# EAGLE design Silent Stepper Driver X Axis (EAGLE 7.5.0)
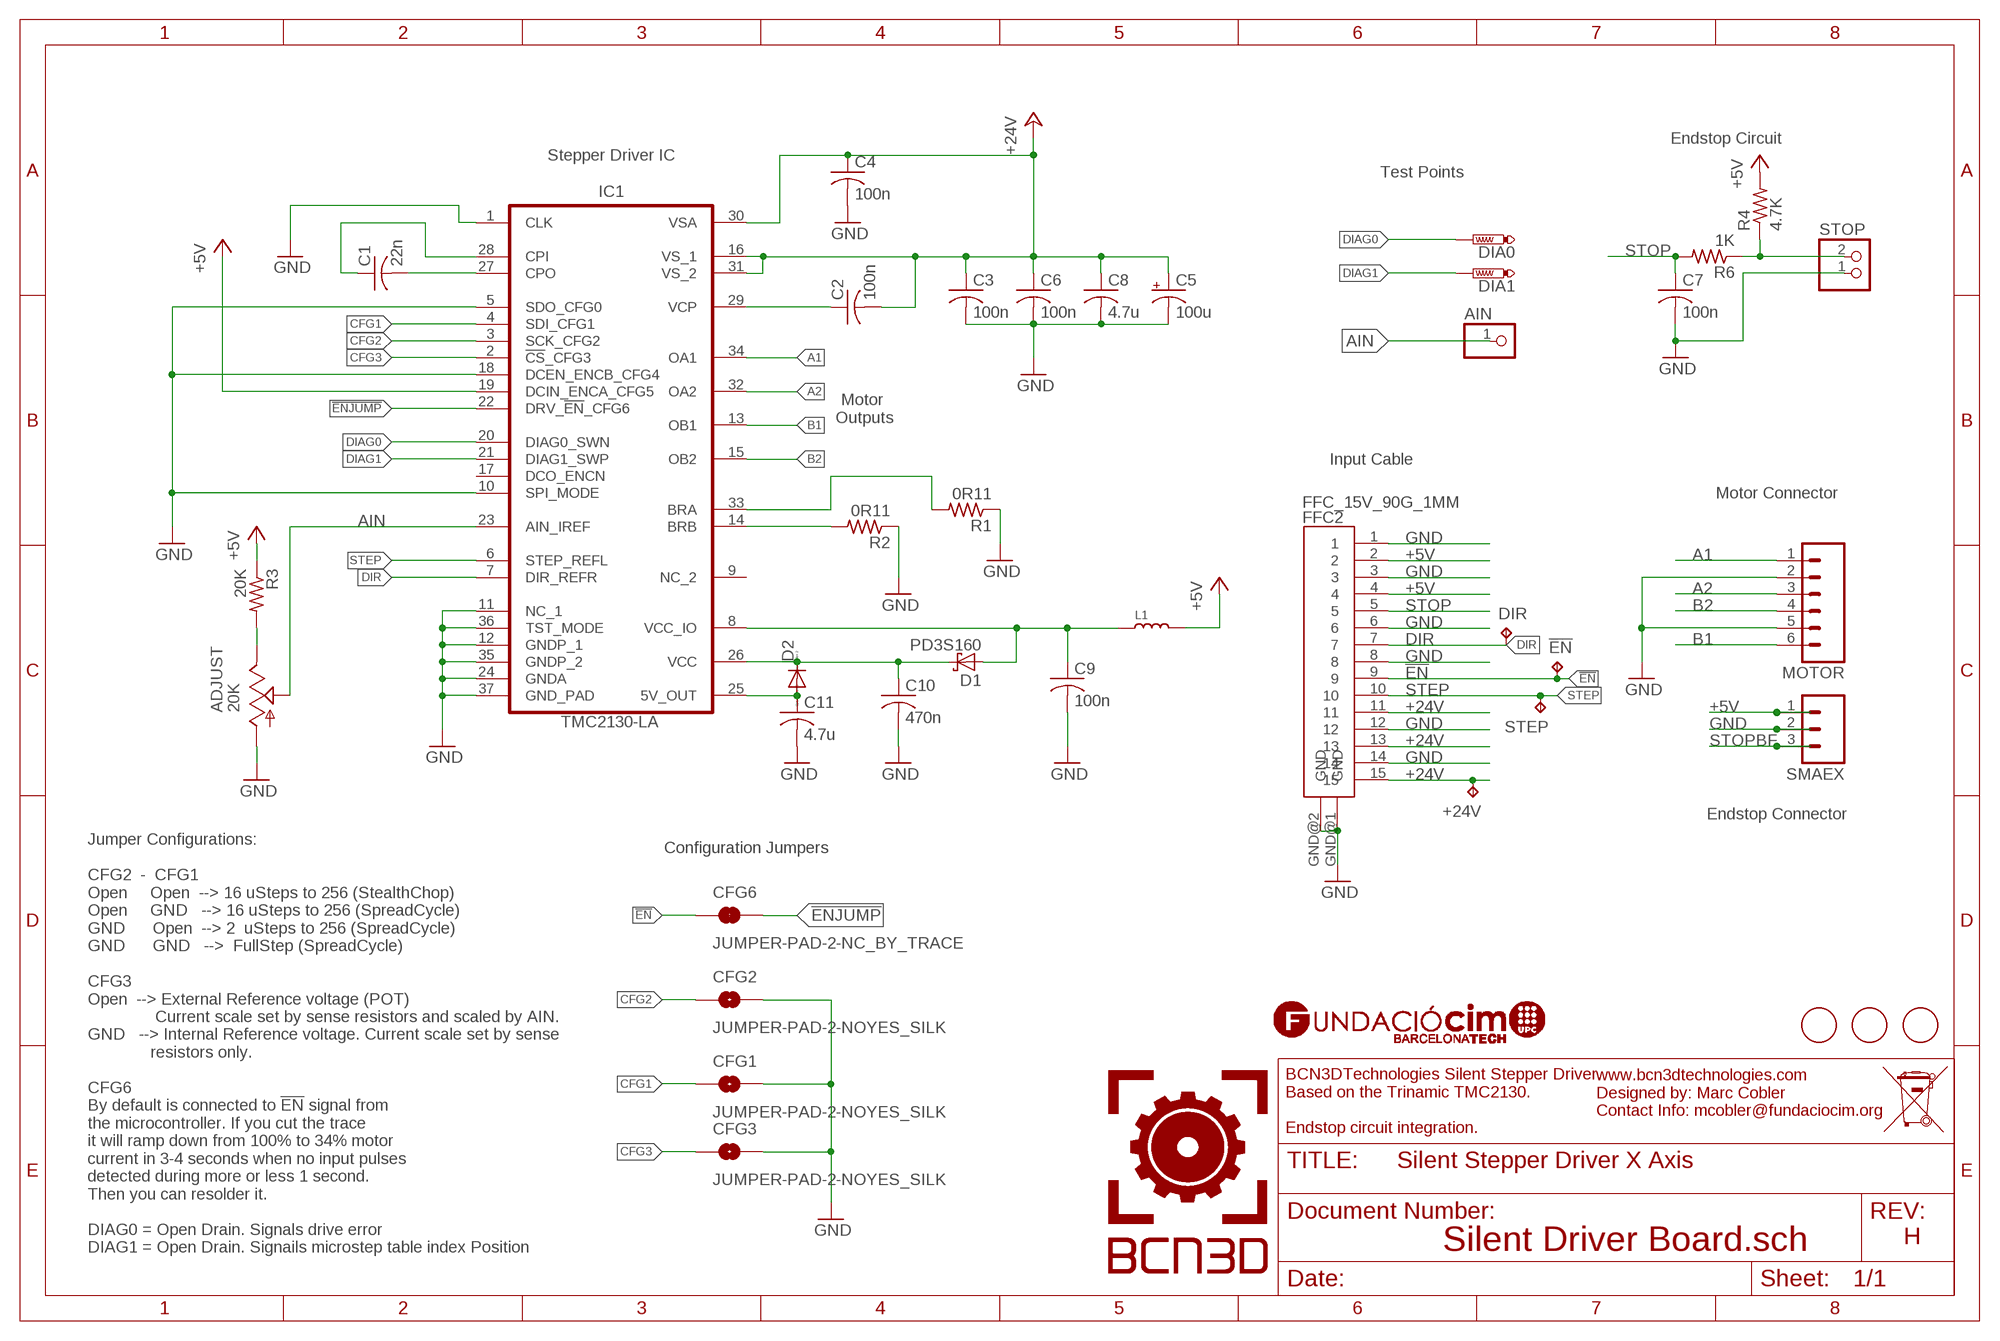
[diagram p0: schematic, sheet 1]

## Parts
!EN  TPB1,27  [B1,27]
+24V  TPB1,27  [B1,27]
ADJUST  20K  TRIM_US-3223G  [3223G]
AIN  PINHD-1X1  [1X01]
C1  22n  C-USC0603K  [C0603K]
C2  100n  C-USC0603K  [C0603K]
C3  100n  C-USC0603K  [C0603K]
C4  100n  C-USC0603K  [C0603K]
C5  100u  CPOL-USUD-6,3X7,7  [UD-6,3X7,7_NICHICON]
C6  100n  C-USC0603K  [C0603K]
C7  100n  C-USC0603K  [C0603K]
C8  4.7u  C-USC1210  [C1210]
C9  100n  C-USC0603K  [C0603K]
C10  470n  C-USC0603K  [C0603K]
C11  4.7u  C-USC0805  [C0805]
CFG1  JUMPER-PAD-2-NOYES_SILK  [PAD-JUMPER-2-NO_YES_SILK]
CFG2  JUMPER-PAD-2-NOYES_SILK  [PAD-JUMPER-2-NO_YES_SILK]
CFG3  JUMPER-PAD-2-NOYES_SILK  [PAD-JUMPER-2-NO_YES_SILK]
CFG6  JUMPER-PAD-2-NC_BY_TRACE  [PAD-JUMPER-2-NC_BY_TRACE_YES_SILK]
D1  PD3S160  [POWERDI323]
D2  DIODE-MINIMELF  [MINIMELF]
DIA0  PTR1TP12R  [TP12R]
DIA1  PTR1TP12R  [TP12R]
DIR  TPB1,27  [B1,27]
FFC2  FFC_15V_90G_1MM  [TE_FFC_CON1MM]
IC1  TMC2130-LA  TMC2130-LA  [TMC_QFN36_0.5_5.0X6.0]
L1  INDUCTOR/FERRITE-BEAD'0603'  [L0603]
MOTOR  M06  [JST-6-PTH]
R1  0R11  R-US_R0805  [R0805]
R2  0R11  R-US_R0805  [R0805]
R3  20K  R-US_R0603  [R0603]
R4  4.7K  R-US_R0603  [R0603]
R6  1K  R-US_R0603  [R0603]
SMAEX  M03PTH  [1X03]
STEP  TPB1,27  [B1,27]
STOP  JST_2PIN-THM-RA  [JST-PH-2-THM-RA]
U$2  FIDUCIAL  [FIDUCIAL_1MM]
U$3  FIDUCIAL  [FIDUCIAL_1MM]
U$4  FIDUCIAL  [FIDUCIAL_1MM]

## Nets
!EN: !EN.TP CFG6.1 FFC2.9
!ENJUMP: CFG6.2 IC1.22(DRV_!EN!_CFG6)
+5V [Signal]: FFC2.2 FFC2.4 IC1.19(DCIN_ENCA_CFG5) L1.2 R3.1 R4.2 SMAEX.1
+24V: +24V.TP C2.2 C3.1 C4.1 C5.+ C6.1 C8.1 FFC2.11 FFC2.13 FFC2.15 IC1.16(VS_1) IC1.30(VSA) IC1.31(VS_2)
A1: IC1.34(OA1) MOTOR.1
A2: IC1.32(OA2) MOTOR.3
AIN: ADJUST.2(S) AIN.1 IC1.23(AIN_IREF)
B1: IC1.13(OB1) MOTOR.6
B2: IC1.15(OB2) MOTOR.4
CFG1: CFG1.1 IC1.4(SDI_CFG1)
CFG2: CFG2.1 IC1.3(SCK_CFG2)
CFG3: CFG3.1 IC1.2(!CS!_CFG3)
DIAG0: DIA0.TP IC1.20(DIAG0_SWN)
DIAG1: DIA1.TP IC1.21(DIAG1_SWP)
DIR: DIR.TP FFC2.7 IC1.7(DIR_REFR)
GND: ADJUST.1(A) C3.2 C4.2 C5.- C6.2 C7.2 C8.2 C9.2 C10.2 C11.2 CFG1.2 CFG2.2 CFG3.2 FFC2.1 FFC2.3 FFC2.6 FFC2.8 FFC2.12 FFC2.14 FFC2.GND@1(GND) FFC2.GND@2(GND) IC1.1(CLK) IC1.5(SDO_CFG0) IC1.10(SPI_MODE) IC1.11(NC_1) IC1.12(GNDP_1) IC1.18(DCEN_ENCB_CFG4) IC1.24(GNDA) IC1.35(GNDP_2) IC1.36(TST_MODE) IC1.37(GND_PAD) MOTOR.2 MOTOR.5 R1.1 R2.1 SMAEX.2 STOP.1
N$1: C1.2 IC1.27(CPO)
N$2: C1.1 IC1.28(CPI)
N$3: C2.1 IC1.29(VCP)
N$4: C11.1 D2.A IC1.25(5V_OUT)
N$5: ADJUST.3(E) R3.2
N$6: C10.1 D1.C D2.C IC1.26(VCC)
N$8: IC1.33(BRA) R1.2
N$9: IC1.14(BRB) R2.2
N$10 [Signal]: C9.1 D1.A IC1.8(VCC_IO) L1.1
STEP: FFC2.10 IC1.6(STEP_REFL) STEP.TP
STOP: C7.1 FFC2.5 R6.2
STOPBF: R4.1 R6.1 SMAEX.3 STOP.2
Unconnected: IC1.9(NC_2) IC1.17(DCO_ENCN)

## Notes on the sheet
- Endstop Circuit
- Stepper Driver IC
- Test Points
- Motor 
  Outputs
- Input Cable
- Motor Connector
- Endstop Connector
- Configuration Jumpers
- www.bcn3dtechnologies.com
  Designed by: Marc Cobler
  Contact Info: mcobler@fundaciocim.org
- BCN3DTechnologies Silent Stepper Driver. 
  Based on the Trinamic TMC2130.
  
  Endstop circuit integration.
- H
- Silent Driver Board.sch
- Jumper Configurations:
  
  CFG2  -  CFG1
  Open     Open  --> 16 uSteps to 256 (StealthChop)
  Open     GND   --> 16 uSteps to 256 (SpreadCycle)
  GND      Open  --> 2  uSteps to 256 (SpreadCycle)
  GND      GND   -->  FullStep (SpreadCycle)
  
  CFG3
  Open  --> External Reference voltage (POT) 
                 Current scale set by sense resistors and scaled by AIN. 
  GND   --> Internal Reference voltage. Current scale set by sense 
                resistors only.
  
  CFG6
  By default is connected to !EN! signal from 
  the microcontroller. If you cut the trace 
  it will ramp down from 100% to 34% motor
  current in 3-4 seconds when no input pulses
  detected during more or less 1 second.
  Then you can resolder it.
  
  DIAG0 = Open Drain. Signals drive error
  DIAG1 = Open Drain. Signails microstep table index Position

## Library data of the parts
!EN +24V DIR STEP = testpad:TP: Test pad
ADJUST = pot:TRIM_US-: POTENTIOMETER; MF: BOURNS; MPN: 3314G-2-203E; OC_FARNELL: 2328481
AIN = pinhead:PINHD-1X1: PIN HEADER; OC_FARNELL: unknown
C1 = rcl:C-US: CAPACITOR, American symbol; MF: MURATA; MPN: GCM188R72A223KA37D; OC_FARNELL: 2494195
C2-C4 C6 C7 C9 = rcl:C-US: CAPACITOR, American symbol; MF: AVX; MPN: 06035C104KAT2A; OC_FARNELL: 1301804
C5 = rcl:CPOL-US: POLARIZED CAPACITOR, American symbol; MF: PANASONIC ELECTRONIC COMPONENTS; MPN: EEE1HA101UAP; OC_FARNELL: 2326148
C8 = rcl:C-US: CAPACITOR, American symbol; MF: KEMET; MPN: C1210X475K5RACTU; OC_FARNELL: 1414067
C10 = rcl:C-US: CAPACITOR, American symbol; MF: MURATA; MPN: GRM188R71C474KA88D; OC_FARNELL: 1828893
C11 = rcl:C-US: CAPACITOR, American symbol; MF: AVX; MPN: 0805YC475KAT2A; OC_FARNELL: 1657937
CFG1-CFG3 = SparkFun-Passives:JUMPER-PAD-2-NO; OC_FARNELL: unknown
CFG6 = SparkFun-Passives:JUMPER-PAD-2-NC_BY_TRACE; OC_FARNELL: unknown
D1 = diode:PD3S160: 1.0A SURFACE MOUNT SCHOTTKY BARRIER RECTIFIER POWERDI ® 323 Source: http://www.diodes.com/datasheets/ds30899.pdf; MF: DIODES INC.; MPN: PD3S160-7; OC_FARNELL: 1843697
D2 = diode:DIODE-: DIODE; MF: NXP; MPN: PMLL4448; OC_FARNELL: 1097279
DIA0 DIA1 = testpad:PTR1: TEST PIN; OC_FARNELL: unknown
FFC2 = MarcEagleParts:FFC_15V_90G_1MM; OC_FARNELL: unknown
IC1 = TMC2130-LA:TMC2130-LA: Universal high voltage driver for two-phase bipolar stepper motor, SPI, Step/Dir, QFN36(5x6); DATASHEET: http://www_trinamic_com/_scripts/download_php?file=_articles%2Fproducts%2Fintegrated-circuits%2Ftmc2130%2F_datasheet%2FTMC2130_datasheet_pdf; DESCRIPTION: Universal high voltage driver for two-phase bipolar stepper motor, SPI, Step/Dir, QFN36(5x6); DISTRIBUTOR1: Digikey; GEOMETRY_HEIGHT: 0_8mm; MANUFACTURER: TRINAMIC; OC_FARNELL: unknown; ORDERCODE-DISTRI1: 1460-1130-1-ND; ORDERCODE-MANU1: TMC2130-LA
L1 = Seeed-OPL-Inductor:INDUCTOR/FERRITE-BEAD; MF: BOURNS; MPN: CRL0603-FW-R470ELF; OC_FARNELL: 2328098
MOTOR = MarcEagleParts:M06: Header 6 Standard 6-pin 0.1" header. Use with straight break away headers (SKU : PRT-00116), right angle break away headers (PRT-00553), swiss pins (PRT-00743), machine pins (PRT-00117), and female headers (PRT-00115). Molex polarized connector foot print use with SKU : PRT-08094 with associated crimp pins and housings. NOTES ON THE VARIANTS LOCK and LOCK_LONGPADS... This footprint was designed to help hold the alignment of a through-hole component (i.e. 6-pin header) while soldering it into place. You may notice that each hole has been shifted either up or down by 0.005 of an inch from it's more standard position (which is a perfectly straight line). This slight alteration caused the pins (the squares in the middle) to touch the edges of the holes. Because they are alternating, it causes a "brace" to hold the component in place. 0.005 has proven to be the perfect amount of "off-center" position when using our standard breakaway headers. Although looks a little odd when you look at the bare footprint, once you have a header in there, the alteration is very hard to notice. Also,if you push a header all the way into place, it is covered up entirely on the bottom side. This idea of altering the position of holes to aid alignment will be further integrated into the Sparkfun Library for other footprints. It can help hold any component with 3 or more connection pins.; MF: JST (JAPAN SOLDERLESS TERMINALS); MPN: S6B-PH-K-S (LF)(SN); OC_FARNELL: 9492500
R1 R2 = rcl:R-US_: RESISTOR, American symbol; MF: PANASONIC ELECTRONIC COMPONENTS; MPN: ERJ6BSFR11V; OC_FARNELL: 2493027
R3 = rcl:R-US_: RESISTOR, American symbol; MF: MULTICOMP; MPN: MC0201L6F2002SE.; OC_FARNELL: 1837767
R4 = rcl:R-US_: RESISTOR, American symbol; MF: PANASONIC ELECTRONIC COMPONENTS; MPN: ERJP06F4701V; OC_FARNELL: 1750763
R6 = rcl:R-US_: RESISTOR, American symbol; MF: BOURNS; MPN: CR0805-JW-102ELF; OC_FARNELL: 2008389
SMAEX = SparkFun-Connectors:M03: Header 3 Standard 3-pin 0.1" header. Use with straight break away headers (SKU : PRT-00116), right angle break away headers (PRT-00553), swiss pins (PRT-00743), machine pins (PRT-00117), and female headers (PRT-00115). Molex polarized connector foot print use with SKU : PRT-08232 with associated crimp pins and housings.; OC_FARNELL: unknown
STOP = adafruit:JST_2PIN: JST 2-Pin Connectors of various flavors SMT-RA (S2B-PH-SM4) 4UConnector #17311 SMT (B2B-PH-SM4) THM-RA (S2B-PH) THM (B2B-PH); MF: JST (JAPAN SOLDERLESS TERMINALS); MPN: S2B-PH-K-S (LF)(SN); OC_FARNELL: 9491902
U$2-U$4 = adafruit:FIDUCIAL: For use by pick and place machines to calibrate the vision/machine, 1mm By microbuilder.eu; OC_FARNELL: unknown

## Net classes
0 Mini Power: width 0.254 mm, drill 0.254 mm, clearance 0.254 mm
1 Medium Power: width 0.305 mm, drill 0.254 mm, clearance 0.305 mm
2 High Power: width 2.54 mm, drill 0.508 mm, clearance 0.508 mm
3 Signal: width 0.229 mm, drill 0.229 mm, clearance 0.229 mm

## Board
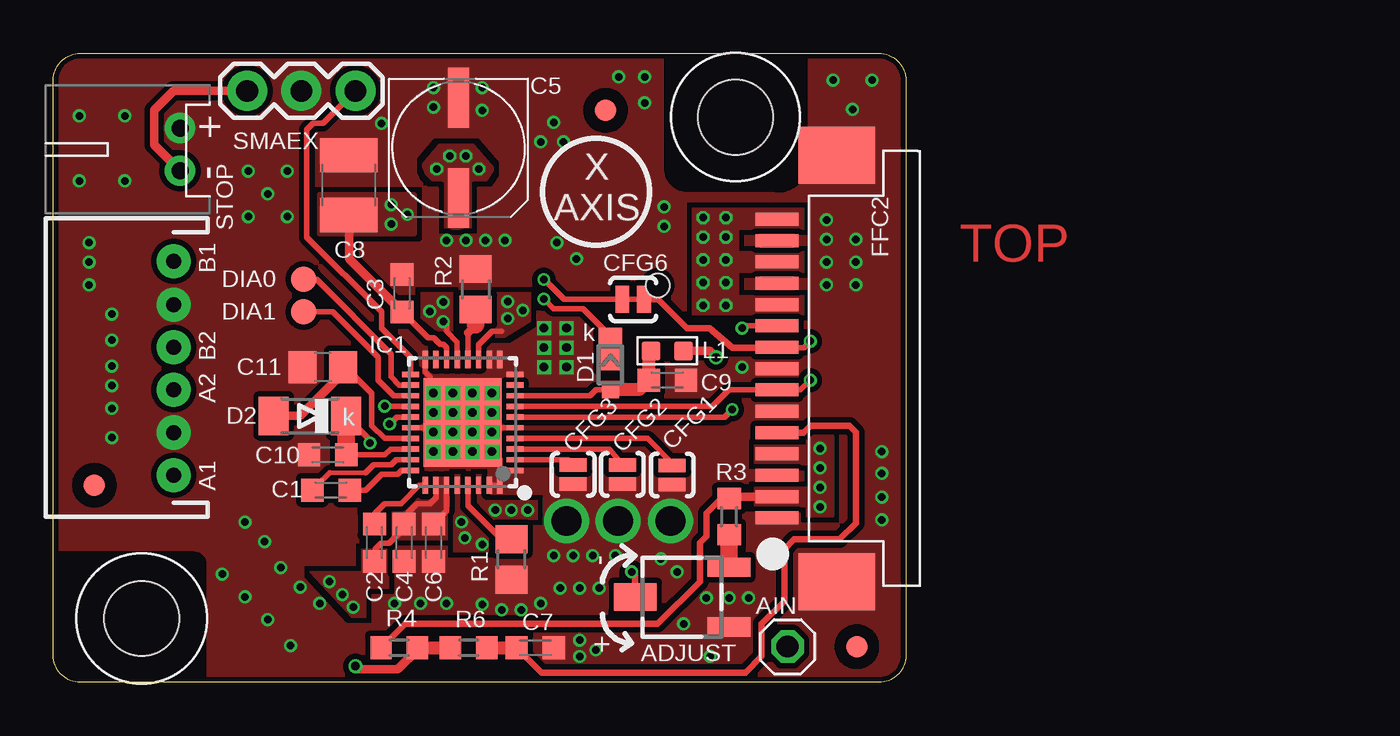
[diagram p1: board, top side]
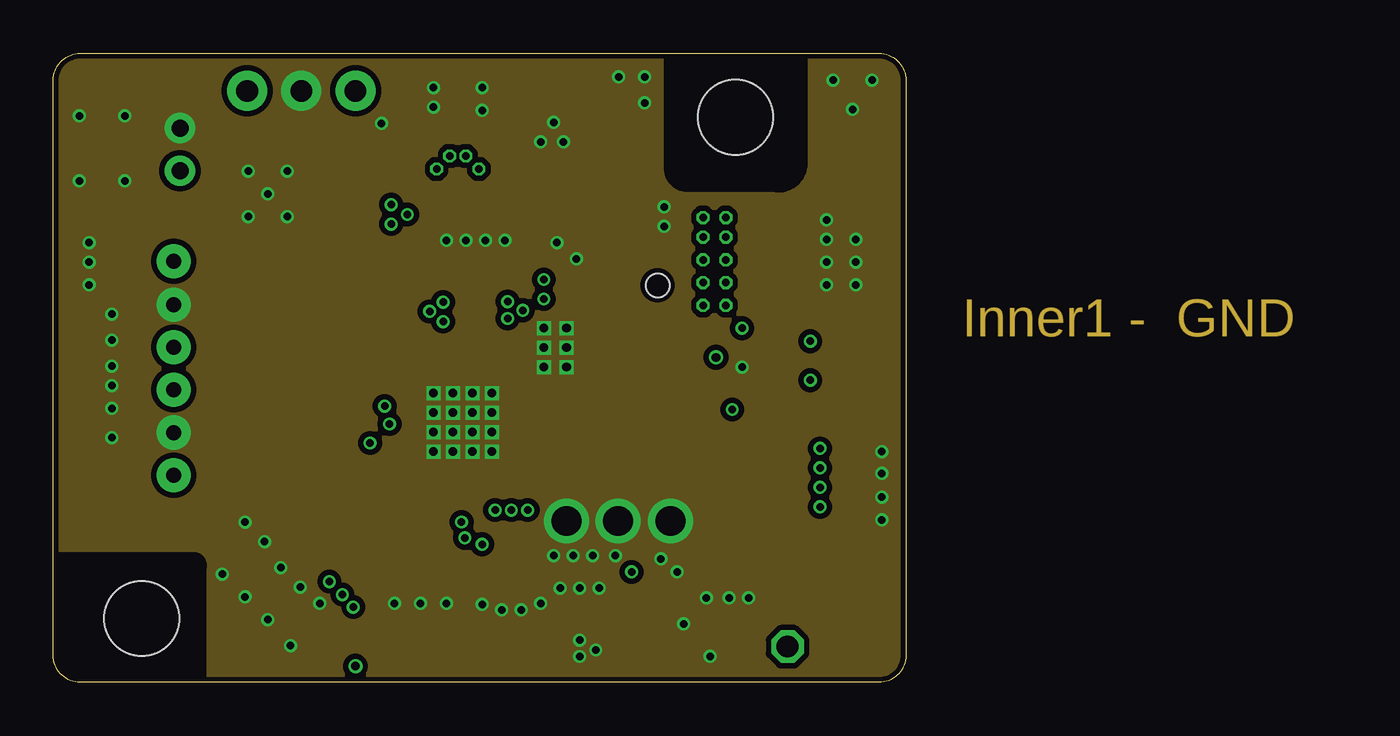
[diagram p2: board, inner layer Inner1]
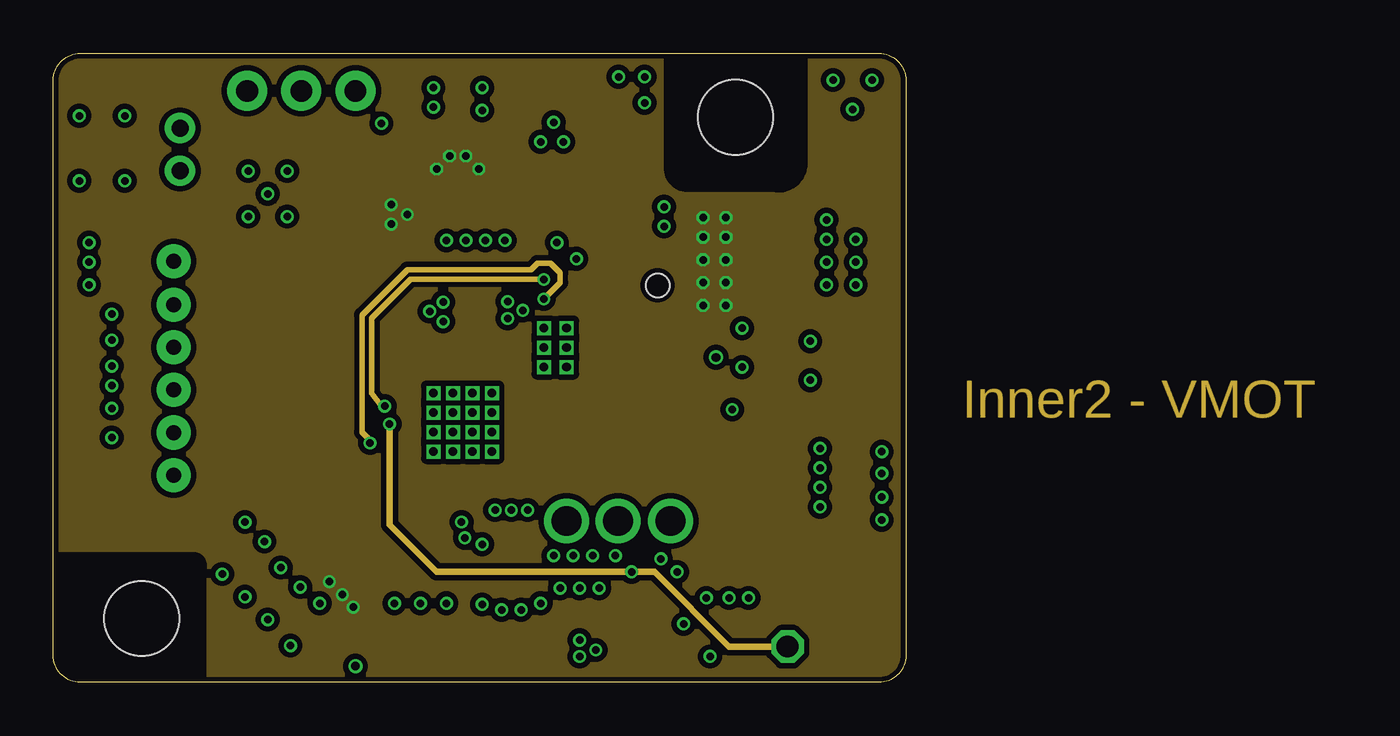
[diagram p3: board, inner layer Inner2]
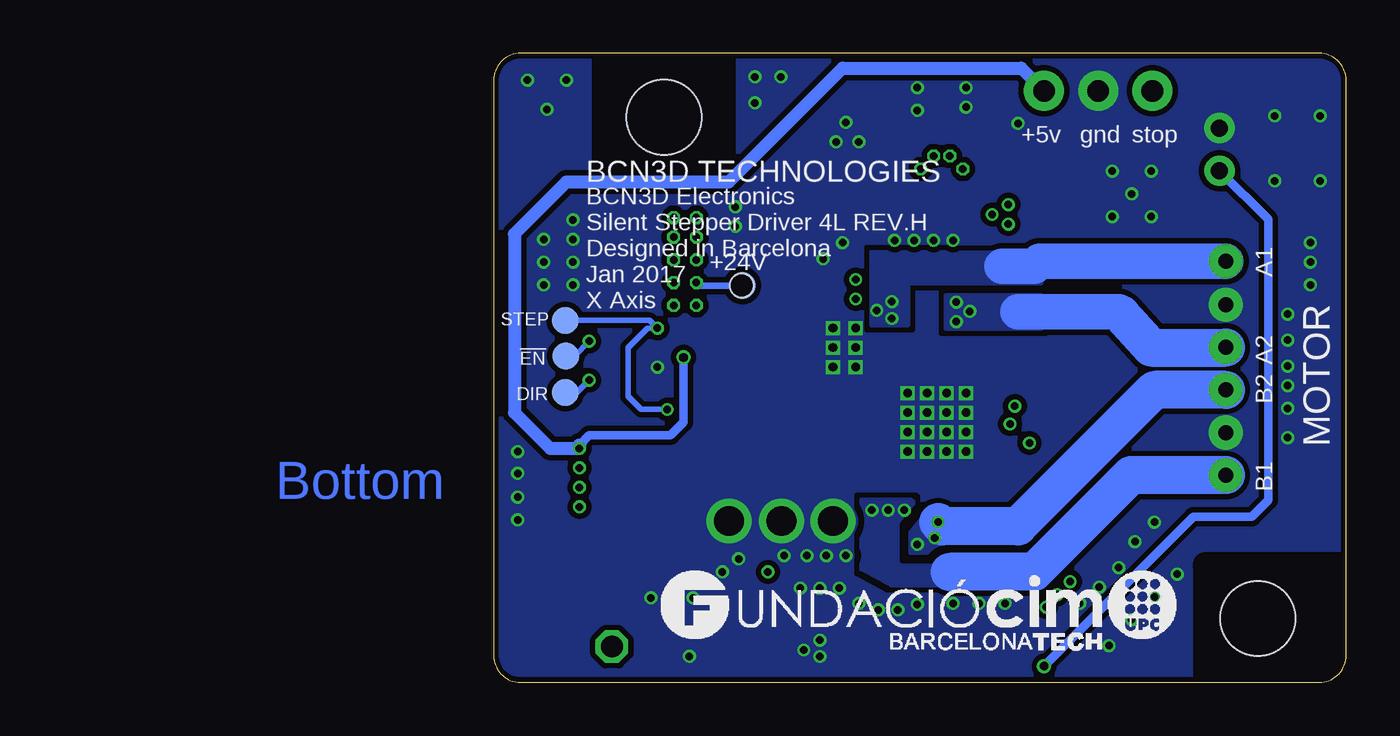
[diagram p4: board, bottom side, seen from below]

Size 40 x 29.5 mm. Coordinates in mm from the lower left corner, seen from the top.
Outline: 38.73,0 1.27,0 arc-90 0,1.27 0,28.23 arc-90 1.27,29.5 38.73,29.5 arc-90 40,28.23 40,1.27 arc-90 38.73,0
Copper layers (1+2*3+16): Top 0.018mm / dielectric 0.36mm / Inner1 0.035mm / dielectric 0.71mm / Inner2 0.035mm / dielectric 0.36mm / Bottom 0.018mm
Design rules "eC_4Layer_PClass6_BaseCopperO18-I35_eCDefault": minimum track width 0.15mm, minimum drill 0.35mm, track to track 0.15mm, track to pad 0.15mm, pad to pad 0.15mm, via to via 0.15mm, smd to smd 0mil, copper to edge 0.25mm, drill to drill 0.35mm, minimum pad ring 0.175mm, minimum via ring 0.125mm, stop-mask expansion 0mil, vias tented up to drill 0.45mm, thermal gap 0.2mm
Holes 3.5 mm at 32,26.5 4.15,3
Holes 1.1 mm at 28.35,18.62

### Footprints (pad centres in the part's own frame; a part is rotated, then mirrored left to right if it is on the bottom)
B1,27 = smd 1.27 x 1.27: TP 0,0
3223G = smd 2 x 0.9: 1 -2.2,1.4; 3 -2.2,-1.4 | smd 2 x 1.3: 2 2.2,0
1X01 = drill 1.016 octagon: 1 0,0
C0603K = smd 1.05 x 1.08: 1 -0.875,0; 2 0.875,0
UD-6,3X7,7_NICHICON = smd 2.8 x 1: + 2.35,0; - -2.35,0
C1210 = smd 1.6 x 2.7: 1 -1.4,0; 2 1.4,0
C0805 = smd 1.3 x 1.5: 1 -0.95,0; 2 0.95,0
PAD-JUMPER-2-NO_YES_SILK = smd 0.635 x 1.27: 1 -0.45,0; 2 0.45,0
PAD-JUMPER-2-NC_BY_TRACE_YES_SILK = smd 0.635 x 1.27: 1 -0.508,0; 2 0.508,0
POWERDI323 = smd 0.8 x 0.8: A 1.15,0 | smd 2 x 1.1: C -0.75,0
MINIMELF = smd 1.4 x 1.8: A 1.7,0; C -1.7,0
TP12R = smd 1.2 x 1.2: TP 0,0
TE_FFC_CON1MM = smd 0.61 x 2: 1 -7.01,2.8; 2 -6.01,2.8; 3 -5.01,2.8; 4 -4.01,2.8; 5 -3.01,2.8; 6 -2.01,2.8; 7 -1.01,2.8; 8 -0.01,2.8; 9 0.99,2.8; 10 1.99,2.8; 11 2.99,2.8; 12 3.99,2.8; 13 4.99,2.8; 14 5.99,2.8; 15 6.99,2.8 | smd 2.68 x 3.6: GND@1 -10,0; GND@2 10,0
TMC_QFN36_0.5_5.0X6.0 = smd 0.25 x 0.8: 1 -2.25,-2.45; 2 -1.75,-2.45; 3 -1.25,-2.45; 4 -0.75,-2.45; 5 -0.25,-2.45; 6 0.25,-2.45; 7 0.75,-2.45; 8 1.25,-2.45; 9 1.75,-2.45; 10 2.25,-2.45; 19 2.25,2.45; 20 1.75,2.45; 21 1.25,2.45; 22 0.75,2.45; 23 0.25,2.45; 24 -0.25,2.45; 25 -0.75,2.45; 26 -1.25,2.45; 27 -1.75,2.45; 28 -2.25,2.45 | smd 0.8 x 0.25: 11 2.95,-1.75; 12 2.95,-1.25; 13 2.95,-0.75; 14 2.95,-0.25; 15 2.95,0.25; 16 2.95,0.75; 17 2.95,1.25; 18 2.95,1.75; 29 -2.95,1.75; 30 -2.95,1.25; 31 -2.95,0.75; 32 -2.95,0.25; 33 -2.95,-0.25; 34 -2.95,-0.75; 35 -2.95,-1.25; 36 -2.95,-1.75 | smd 4.15 x 3.65: 37 0,0
L0603 = smd 0.889 x 0.889: 1 -0.762,0; 2 0.762,0
JST-6-PTH = drill 0.7 pad 1.6: 1 -4,0; 2 -2,0; 3 0,0; 4 2,0; 5 4,0; 6 6.032,0
R0805 = smd 1.3 x 1.5: 1 -0.95,0; 2 0.95,0
R0603 = smd 1 x 1.1: 1 -0.85,0; 2 0.85,0
1X03 = drill 1.016 pad 1.88: 1 0,0; 2 2.54,0; 3 5.08,0
JST-PH-2-THM-RA = drill 0.8 pad 1.422: 1 1,0; 2 -1,0
FIDUCIAL_1MM = smd 1 x 1: 1 0,0

### Placement (x,y rotation side)
!EN  36.62,15.3 270 bottom
+24V  28.34,18.61 270 bottom
ADJUST  29.5,4 180 top
AIN  34.44,1.68 90 top
C1  13.03,9.02 180 top
C2  15.06,6.55 270 top
C3  16.36,18.25 90 top
C4  16.46,6.55 270 top
C5  19.01,25.06 270 top
C6  17.83,6.55 270 top
C7  22.61,1.63 0 top
C8  13.87,23.32 90 top
C9  28.8,14.17 0 top
C10  12.88,10.67 180 top
C11  12.65,14.78 180 top
CFG1  29.03,9.73 270 top
CFG2  26.7,9.75 270 top
CFG3  24.38,9.75 270 top
CFG6  27.2,17.96 180 top
D1  26.14,14.88 270 top
D2  12.04,12.5 180 top
DIA0  11.73,18.9 0 top
DIA1  11.73,17.37 0 top
DIR  36.63,13.6 270 bottom
FFC2  36.75,14.72 90 top
IC1  19.2,12.19 90 top
L1  28.8,15.54 0 top
MOTOR  5.64,13.72 90 top
R1  21.49,5.77 90 top
R2  19.81,18.44 270 top
R3  31.7,7.77 270 top
R4  16.23,1.63 180 top
R6  19.48,1.63 0 top
SMAEX  14.17,27.74 180 top
STEP  36.63,16.98 270 bottom
STOP  5.94,24.99 90 top
U$2  37.69,1.68 0 top
U$3  1.93,9.25 0 top
U$4  25.91,26.82 0 top
U$5  [FCIM_LOGO]  33.99,-2.13 0 bottom

### Tracks (layer width: path | path; a pad name or v marks a point on that pad's centre or on a via)
!EN  (via drill 0.36)
  Top 0.254: 33.96,15.7 35.2,15.7 v35.51,16
  Top 0.305: 33.93,15.7 31.85,15.7 30.79,16.61 29.72,16.61 28.37,17.96 CFG6.1
  Top 0.356: 33.93,15.7 FFC2.9 33.96,15.7
  Bottom 0.254: v35.51,16 36.21,15.3 !EN.TP
!ENJUMP  (via drill 0.35)
  Top 0.254: CFG6.2 23.95,17.96 v23.01,18.9 | v15.54,12.95 15.71,12.94 IC1.22
  Inner2 0.254: v23.01,18.9 16.76,18.9 14.94,17.07 14.94,13.56 15.39,12.95 v15.54,12.95
+5V  (via drill 0.36, 0.41)
  Top 0.254: IC1.19 16.75,15.25 15.39,16.61 15.39,17.37 11.89,20.88 11.89,25.91 12.19,26.21 12.65,26.21 SMAEX.1
  Top 0.305: FFC2.2 33.92,8.69 | R4.2 16.5,2.74 28.35,2.74 30.33,4.72 30.33,6.55 30.63,6.86 30.63,7.92 31.42,8.71 32.31,8.71 | 31.48,8.62 R3.1
  Top 0.406: v31.09,15.24 30.79,15.54 L1.2 | FFC2.2 32.31,8.71 31.79,8.71 R3.1
  Bottom 0.406: v31.09,15.24 31.09,12.19 31.7,11.58 35.51,11.58 35.97,11.12
  Bottom 0.61: SMAEX.1 15.24,28.8 23.62,28.8 28.96,23.47 36.58,23.47 39.01,21.03 39.01,12.65 37.34,10.97 v35.97,10.97 35.97,11.12
  other vias: 35.97,10.06 35.97,9.14 35.97,8.23
  pour Top (no thermals): 32.92,11.13 35.36,11.13 35.36,11.58 36.58,11.58 36.58,7.77 35.36,7.77 35.36,8.23 32.92,8.23 32.92,9.14 35.51,9.14 35.51,10.21 32.92,10.21
+24V  (via drill 0.35, 0.36, 0.36 pad 0.41)
  Top 0.254: IC1.31 18.45,8.05 C6.1 | IC1.30 17.95,8.66 17.68,8.38 17.07,8.38 16.61,7.92 16.61,7.58 C4.1 16.46,7.24 15.75,6.53 15.37,6.53 15.09,6.25 15.09,5.7 C2.2 | IC1.16 18.45,15.69 18.29,15.85 18.14,15.85 17.83,16.15 17.58,16.15 C3.1
  Top 0.406: C3.1 13.87,19.87 C8.1
  Bottom 0.305: +24V.TP 30.34,18.61 v30.48,18.75
  other vias: 16.61,21.95 15.85,21.49 15.85,22.4 30.48,21.79 31.55,21.79 31.55,20.88 30.48,20.88 31.55,19.81 30.48,19.81 31.55,18.75 31.55,17.68 30.48,17.68 17.98,24.08 18.59,24.69 19.35,24.69 19.96,24.08 13.56,4.11 14.07,3.53 12.95,4.72
  pour Top (no thermals): 35.2,22.25 29.97,22.25 29.97,17.22 35.2,17.22 35.2,18.16 32.16,18.16 32.16,19.2 35.2,19.2 35.2,20.22 32.16,20.22 32.16,21.23 35.2,21.23
  pour Top (no thermals): 12.5,22.86 16.92,22.86 16.92,21.03 12.5,21.03
  pour Inner2 (rank 6, no thermals): 0,29.72 28.5,29.72 28.5,24.13 arc90 29.77,22.86 33.78,22.86 arc90 35.51,24.13 35.51,29.72 40.08,29.72 40.08,-0.15 7.32,-0.15 7.32,5.26 arc91 6.78,6.22 0,6.25
  pour Top (no thermals): 18.14,25.15 19.66,25.15 20.57,24.08 20.27,23.62 19.66,23.62 19.51,23.47 19.51,21.34 18.44,21.34 18.44,23.47 18.29,23.62 17.83,23.62 17.53,23.93 17.37,24.23
  pour Top (no thermals): 14.48,6.25 15.7,6.25 15.7,4.42 14.63,4.42 14.63,3.05 14.02,3.05 12.04,5.18 14.48,5.18
  pour Top (isolate 0.254, rank 2, no thermals): 17.68,9.6 17.68,8.69 15.7,8.69 15.7,6.71 18.75,6.71 18.75,9.6
A1  (via drill 0.35)
  Bottom 1.778: MOTOR.1 10.1,9.72 14.63,5.18 18.59,5.18
  other vias: 20.73,8.08 21.49,8.08 22.25,8.08
  pour Top (no thermals): 19.81,9.75 19.81,8.38 20.57,7.62 22.71,7.62 22.71,8.53 20.27,8.53 20.12,8.69 20.12,9.75
  pour Bottom (isolate 0.406, rank 2, no thermals): 17.98,5.79 20.88,5.79 20.88,7.16 19.96,8.23 20.42,8.53 22.71,8.53 22.71,5.33 21.34,4.57 17.98,4.57
A2  (via drill 0.35)
  Bottom 1.778: MOTOR.3 8.99,13.72 15.39,7.32 18.95,7.32 v19.15,7.52
  other vias: 20.12,6.48 19.3,6.78
  pour Top (no thermals): 18.75,9.75 19.2,9.75 19.2,8.38 20.42,7.16 20.42,6.1 18.75,6.1
  pour Bottom (isolate 0.406, no thermals): 19.66,7.92 20.42,7.01 20.42,6.1 18.14,6.1 18.44,7.92
AIN  (via drill 0.35, 0.36)
  Top 0.254: IC1.23 16.1,12.44 v15.77,12.12
  Top 0.305: ADJUST.2 27.3,5.01 v27.13,5.18
  Inner2 0.305: AIN.1 31.7,1.68 28.19,5.18 v27.13,5.18 17.98,5.18 15.77,7.39 v15.77,12.12
B1  (via drill 0.35)
  Top 0.254: IC1.13 19.95,15.84 20.57,16.46 21.03,16.46
  Bottom 1.676: MOTOR.6 14.39,19.75 14.63,19.51 16.15,19.51
  other vias: 21.31,17.07 21.31,17.86 22.02,17.45
  pour Top (no thermals): 22.4,18.29 22.4,16.92 21.18,16.15 20.73,16.15 20.73,18.29
  pour Bottom (no thermals): 22.25,16.76 20.57,16.76 20.57,18.75 14.33,18.75 14.33,20.12 22.25,20.17
B2  (via drill 0.35)
  Top 0.254: IC1.15 18.95,15.95 18.44,16.46 18.44,16.76 v18.29,16.92
  Bottom 1.676: 10.54,17.25 10.67,17.37 15.39,17.37
  Bottom 1.778: 10.54,17.25 9.14,15.7 5.66,15.7 MOTOR.4
  other vias: 18.29,17.83 17.65,17.4
  pour Top (no thermals): 17.22,18.29 18.75,18.29 18.75,16.46 17.98,16.46 17.22,17.07
  pour Bottom (rank 2, no thermals): 14.33,16.61 14.33,18.14 18.75,18.14 18.75,16.61
CFG1
  Top 0.254: IC1.4 27.87,11.44 29.03,10.28 CFG1.1
CFG2
  Top 0.254: IC1.3 26.08,10.94 CFG2.1
CFG3
  Top 0.254: CFG3.1 24.15,10.44 IC1.2
DIAG0
  Top 0.254: IC1.20 16.23,13.94 15.85,14.33 15.85,15.39 12.34,18.9 DIA0.TP
DIAG1
  Top 0.254: IC1.21 15.97,13.44 15.24,14.17 15.24,15.24 13.11,17.37 DIA1.TP
DIR  (via drill 0.36)
  Top 0.254: IC1.7 30.93,12.94 31.7,13.71 FFC2.7 35.05,13.71 v35.51,14.17
  Bottom 0.254: v35.51,14.17 36.08,13.6 DIR.TP
GND  (via drill 0.35, 0.36, 0.41, 1.4 pad 1.42)
  Top 0.254: IC1.35 IC1.36 20.95,10.44 v20.57,10.82 | IC1.24 17.62,11.94 v17.83,11.73 | IC1.5 20.78,11.94 v20.57,11.73 | IC1.18 17.45,14.55 17.68,14.33 17.68,13.72 v17.83,13.56
  other vias: 18.75,13.56 19.66,13.56 20.57,13.56 17.83,12.65 18.75,12.65 19.66,12.65 20.57,12.65 18.75,11.73 19.66,11.73 17.83,10.82 18.75,10.82 19.66,10.82 26.49,7.57 24.08,7.57 28.96,7.57 20.12,3.66 21.03,3.4 21.95,3.4 22.86,3.71 24.69,1.98 24.69,1.22 25.45,1.52 30.63,3.96 31.7,3.96 32.61,3.96 18.44,20.73 19.35,20.73 20.27,20.73 21.18,20.73 17.83,27.89 17.83,26.97 20.12,27.89 20.12,26.82 15.39,26.21 32.31,14.78 38.86,10.82 38.86,8.69 38.86,7.62 24.08,16.61 23.01,16.61 23.01,15.7 24.08,15.7 23.01,14.78 24.08,14.78 25.6,4.42 24.69,4.42 23.77,4.42 25.3,5.94 26.37,5.94 24.38,5.94 23.47,5.94 29.26,5.18 29.57,2.74 30.81,1.22 1.68,20.62 1.68,19.71 1.68,18.64 2.74,17.27 2.74,16.05 2.74,14.83 2.74,13.92 2.74,12.85 2.74,11.48 10.97,21.84 9.14,21.84 10.06,22.91 10.97,23.98 9.14,23.98 3.35,23.52 3.35,26.57 1.22,26.57 1.22,23.52 23.47,26.26 22.86,25.35 23.93,25.35 27.74,28.4 23.62,20.62 24.54,19.86 28.65,21.39 28.65,22.3 36.27,18.64 36.27,19.71 36.27,20.78 36.27,21.69 8.99,7.52 9.91,6.6 10.67,5.38 11.58,4.47 7.92,5.08 8.99,4.01 10.06,2.95 11.13,1.73 12.5,3.71 26.52,28.4 27.74,27.18 28.5,5.79 16,3.71 17.22,3.71 18.44,3.71 36.58,28.24 38.4,28.24 37.49,26.87 37.64,20.78 37.64,19.71 38.86,9.8 37.64,18.64
  pour Top (rank 6, no thermals): 0,29.72 28.5,29.72 28.5,24.13 arc90 29.77,22.86 33.78,22.86 arc90 35.51,24.13 35.51,29.72 40.13,29.72 40.13,-0.25 7.32,-0.15 7.32,5.6 arc91 6.63,6.26 0,6.29
  pour Bottom (rank 6, no thermals): 0,29.72 28.5,29.72 28.5,24.13 arc90 29.77,22.86 33.78,22.86 arc90 35.51,24.13 35.51,29.72 40.08,29.72 40.08,-0.15 7.32,-0.15 7.32,5.26 arc91 6.78,6.22 0,6.25
  pour Bottom (rank 6, no thermals): 0,29.72 28.5,29.72 28.5,24.13 arc90 29.77,22.86 33.78,22.86 arc90 35.51,24.13 35.51,29.72 40.08,29.72 40.08,-0.15 7.32,-0.15 7.32,5.26 arc91 6.78,6.22 0,6.25
  pour Bottom (rank 6, no thermals): 0,29.72 28.5,29.72 28.5,24.13 arc90 29.77,22.86 33.78,22.86 arc90 35.51,24.13 35.51,29.72 40.08,29.72 40.08,-0.15 7.32,-0.15 7.32,5.26 arc91 6.78,6.22 0,6.25
  pour Inner1 (rank 6, no thermals): 0,29.72 28.5,29.72 28.5,24.13 arc90 29.77,22.86 33.78,22.86 arc90 35.51,24.13 35.51,29.72 40.08,29.72 40.08,-0.15 7.32,-0.15 7.32,5.26 arc91 6.78,6.22 0,6.25
N$1
  Top 0.203: 12.97,9.83 14.66,9.83
  Top 0.254: C1.2 12.97,9.83 | 14.66,9.83 15.04,10.21 15.85,10.21 16.08,10.44 IC1.27
N$2
  Top 0.254: C1.1 14.66,9.02 15.39,9.75 16.15,9.75 16.34,9.94 IC1.28
N$3
  Top 0.254: IC1.29 17.17,9.24 16.31,8.38 15.54,8.38 15.09,7.92 15.09,7.45 C2.1
N$4
  Top 0.254: IC1.25 15.53,11.44 14.94,12.04 14.94,13.56 13.72,14.78 C11.1
  Top 0.406: D2.A 11.58,12.5 13.6,14.51 C11.1
N$5
  Top 0.813: R3.2 ADJUST.3
N$6  (via drill 0.35)
  Top 0.254: C10.1 15.54,10.67 15.82,10.94 IC1.26 | D1.C 26.14,16.23 24.84,17.53 23.47,17.53 v23.01,17.98 | D2.C 13.89,12.32 14.86,11.35 v14.86,11.23
  Top 0.813: C10.1 13.89,10.68 13.74,10.83 D2.C
  Inner2 0.254: v14.86,11.23 14.86,11.35 14.48,11.73 14.48,17.22 16.61,19.36 22.4,19.36 22.71,19.66 23.32,19.66 23.77,19.2 23.77,18.75 v23.01,17.98
N$8
  Top 0.254: 20.88,6.71 21.48,6.71 R1.2 21.02,6.72 19.96,7.77 19.45,8.28 IC1.33
N$9
  Top 0.254: R2.2 19.91,17.28 | 19.45,16.4 IC1.14
  Top 0.406: 19.45,16.4 19.81,16.76
  Top 0.813: 19.81,16.76 R2.2
N$10
  Top 0.254: IC1.8 25.18,13.44 25.45,13.72 26.12,13.72 D1.A
  Top 0.61: L1.1 27.93,15.43 C9.1 27.49,13.73 D1.A
STEP  (via drill 0.35, 0.36)
  Top 0.254: IC1.6 31.49,12.44 v31.85,12.8 | FFC2.10 32.41,16.71 v32.31,16.61
  Bottom 0.254: v31.85,12.8 33.07,12.8 33.68,13.41 33.68,15.7 32.77,16.61 v32.31,16.61 32.68,16.98 STEP.TP
STOP
  Top 0.305: C7.1 22.9,0.46 32.46,0.46 33.22,1.22 33.22,2.74 34.29,3.81 34.29,6.25 34.75,6.71 36.88,6.71 37.64,7.47 37.64,11.73 37.34,12.04 35.51,12.04 35.18,11.71 FFC2.5
  Top 0.61: R6.2 C7.1
STOPBF  (via drill 0.41)
  Top 0.406: R4.1 17.08,1.54 16.15,0.61 14.33,0.61 v14.17,0.76 | STOP.2 4.72,25.21 4.72,26.82 5.64,27.74 SMAEX.3
  Top 0.61: R4.1 R6.1
  Bottom 0.406: STOP.2 3.66,21.71 3.66,8.53 4.42,7.77 7.16,7.77 v14.17,0.76

### Text on the board
Top: TOP
Inner1: Inner1 - GND
Inner2: Inner2 - VMOT
Bottom: Bottom
tPlace: X / AXIS | B1 | k | B2 | A2 | k | A1 | - | +
bPlace: stop | gnd | +5v | BCN3D TECHNOLOGIES | A1 | A2 | BCN3D Electronics / Silent Stepper Driver 4L REV.H / Designed in Barcelona / Jan 2017 / X Axis | B2 | B1
DrillLegend_01-16: 01-16
DrillLegend_01-20: 01-20